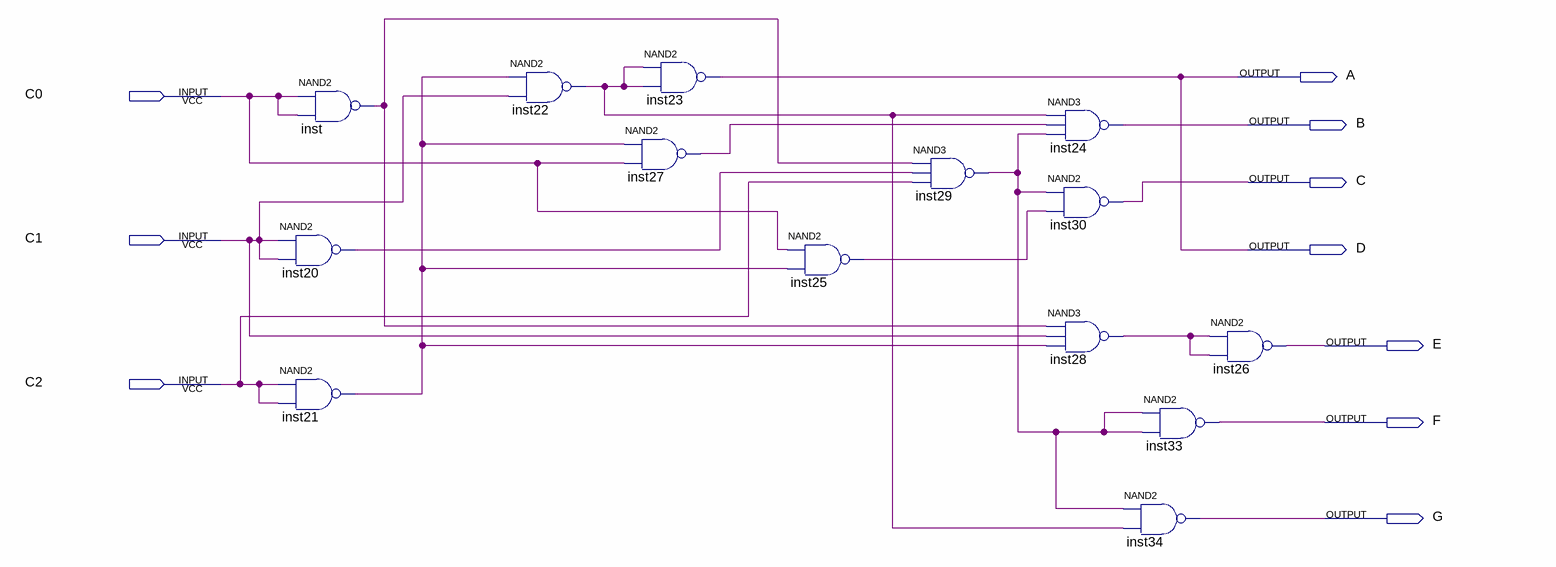
[diagram p0: schematic sheet]
// Quartus schematic decoder_nda2_2.bdf as structural Verilog: 14 symbols, 10 pins
module decoder_nda2_2 (
  input  C0,
  input  C1,
  input  C2,
  output A,
  output B,
  output C,
  output D,
  output E,
  output F,
  output G
);

  wire inst20_out, inst21_out, inst22_out, inst25_out, inst27_out, inst28_out, inst29_out, inst_out;

  nand inst20 (inst20_out, C1, C1);
  nand inst21 (inst21_out, C2, C2);
  nand inst (inst_out, C0, C0);
  nand inst22 (inst22_out, inst21_out, C1);
  nand inst23 (A, inst22_out, inst22_out);
  nand inst27 (inst27_out, inst21_out, C0);
  nand inst25 (inst25_out, C0, inst21_out);
  nand inst29 (inst29_out, inst_out, inst20_out, C2);
  nand inst24 (B, inst22_out, inst27_out, inst29_out);
  nand inst30 (C, inst29_out, inst25_out);
  nand inst28 (inst28_out, inst_out, C1, inst21_out);
  nand inst34 (G, inst29_out, inst22_out);
  nand inst26 (E, inst28_out, inst28_out);
  nand inst33 (F, inst29_out, inst29_out);

  assign D = A;
endmodule
